# Altium schematic sheet [03] - 28Pins Schematic.SchDoc (part 1 of 3)
size E portrait; DocumentNumber: 3; SheetNumber: 3; SheetTotal: 5
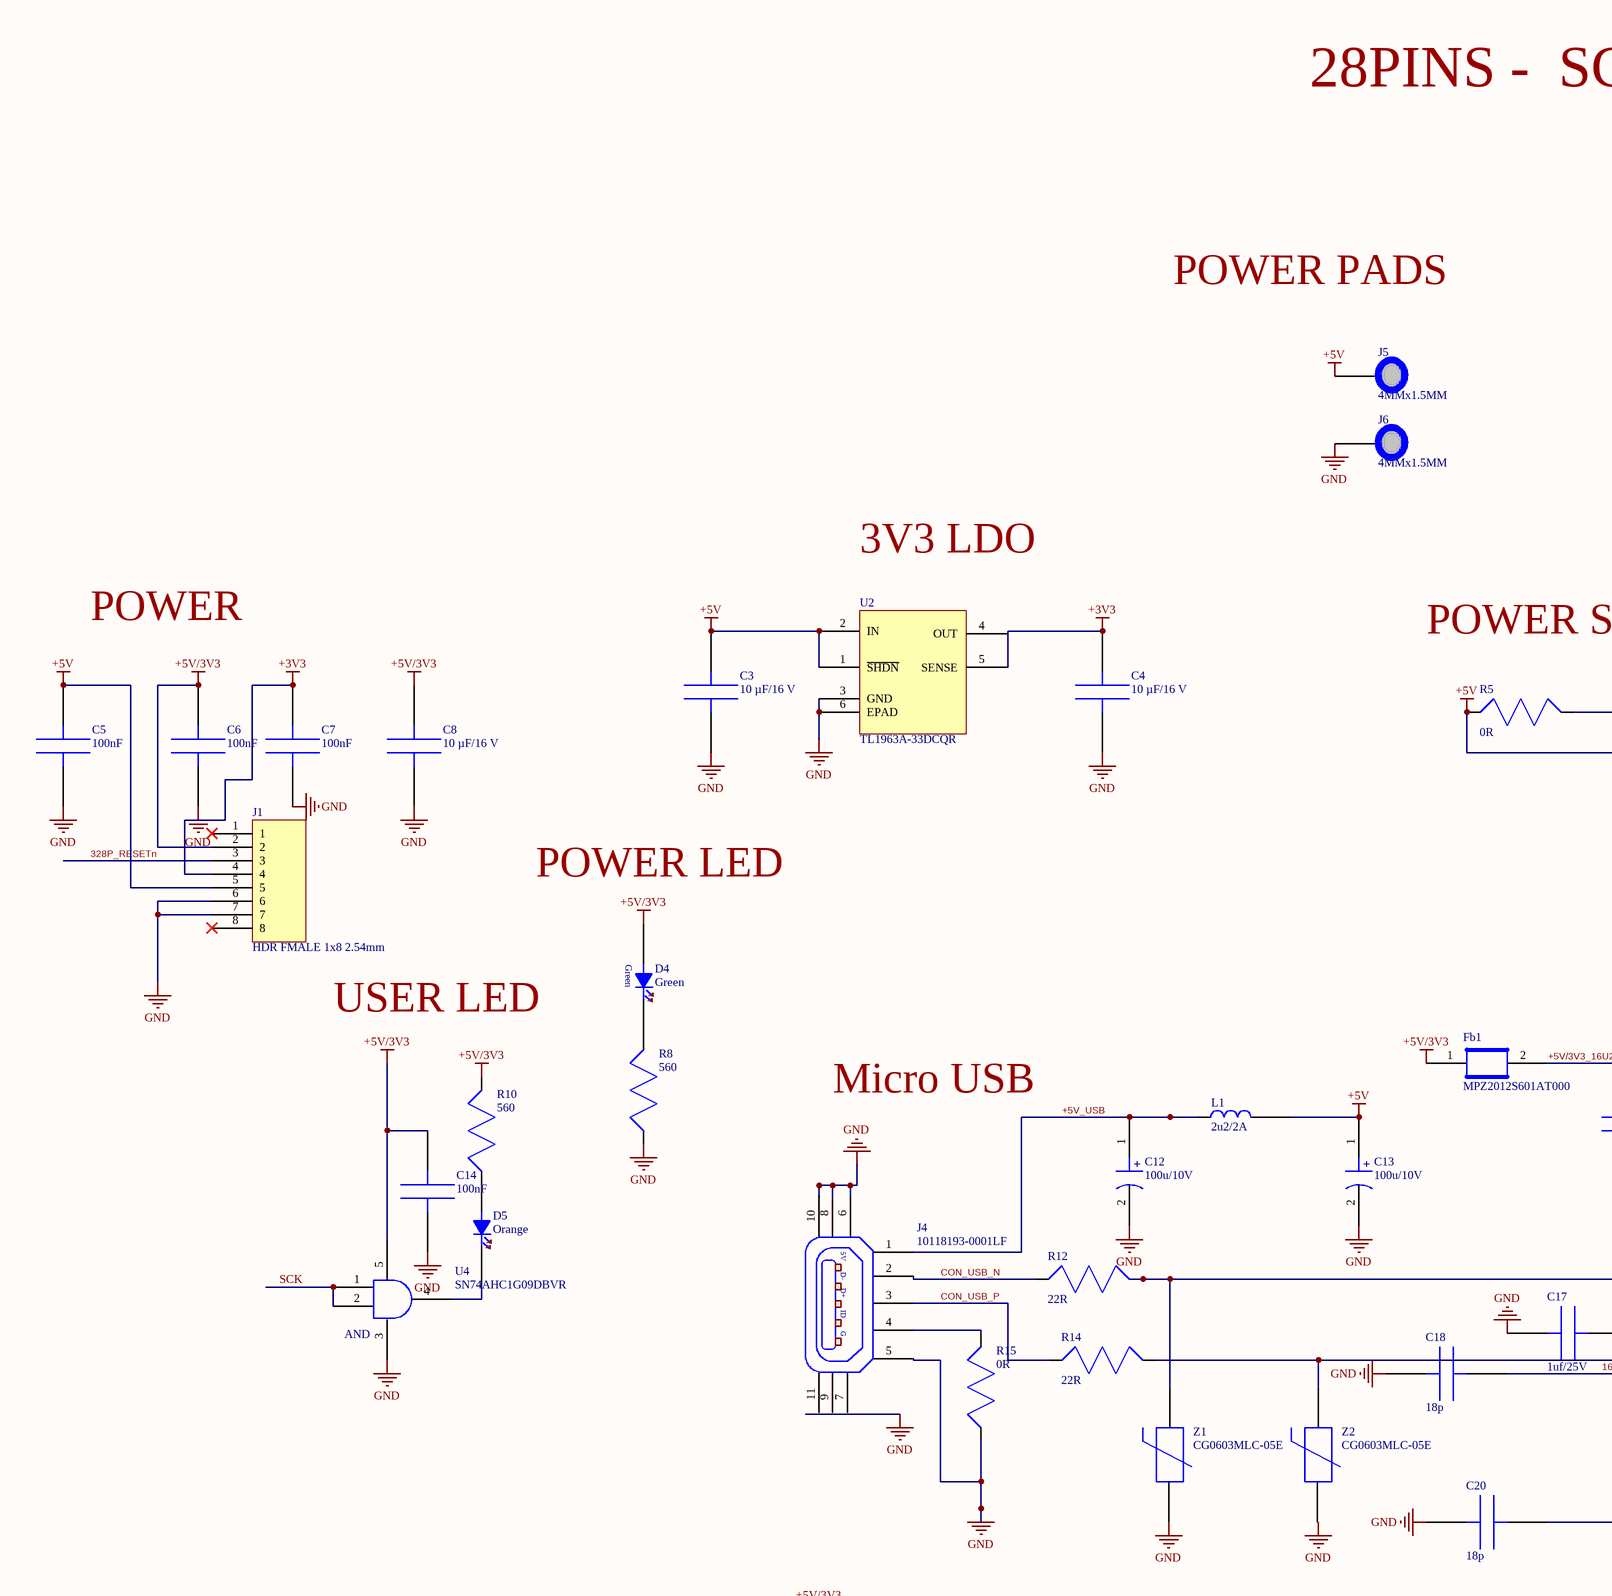
[diagram p0: [03] - 28Pins Schematic.SchDoc, top left]
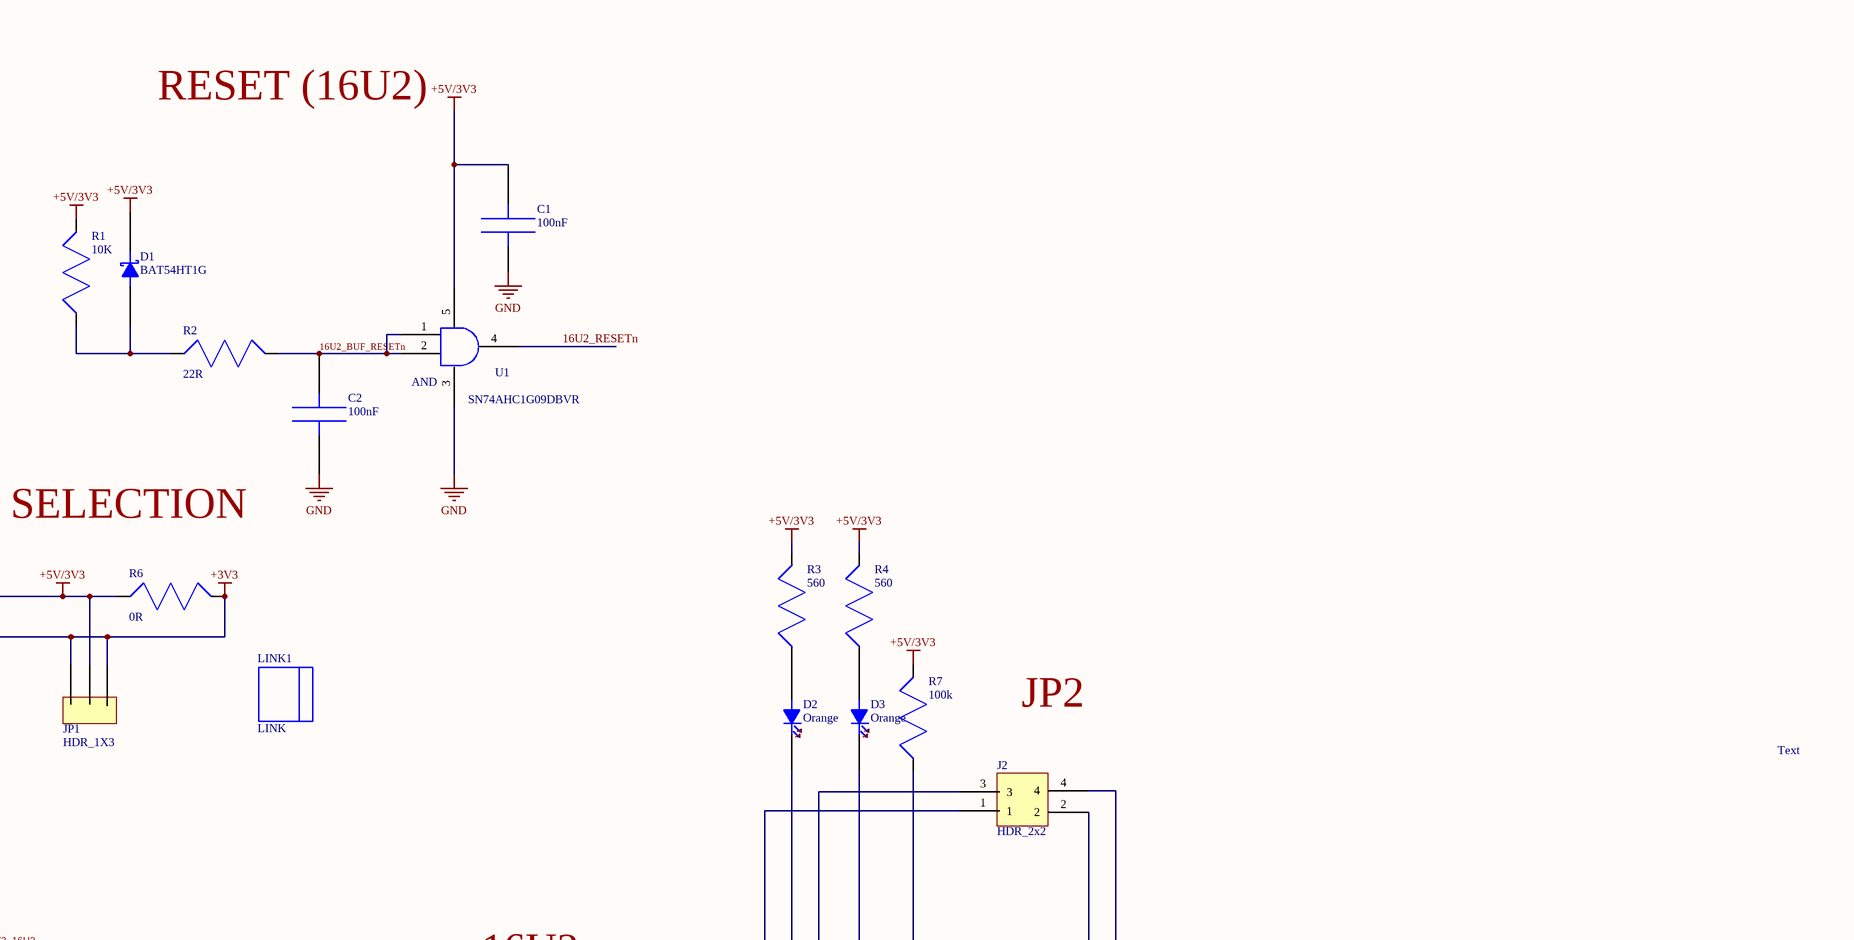
[diagram p1: [03] - 28Pins Schematic.SchDoc, top right]
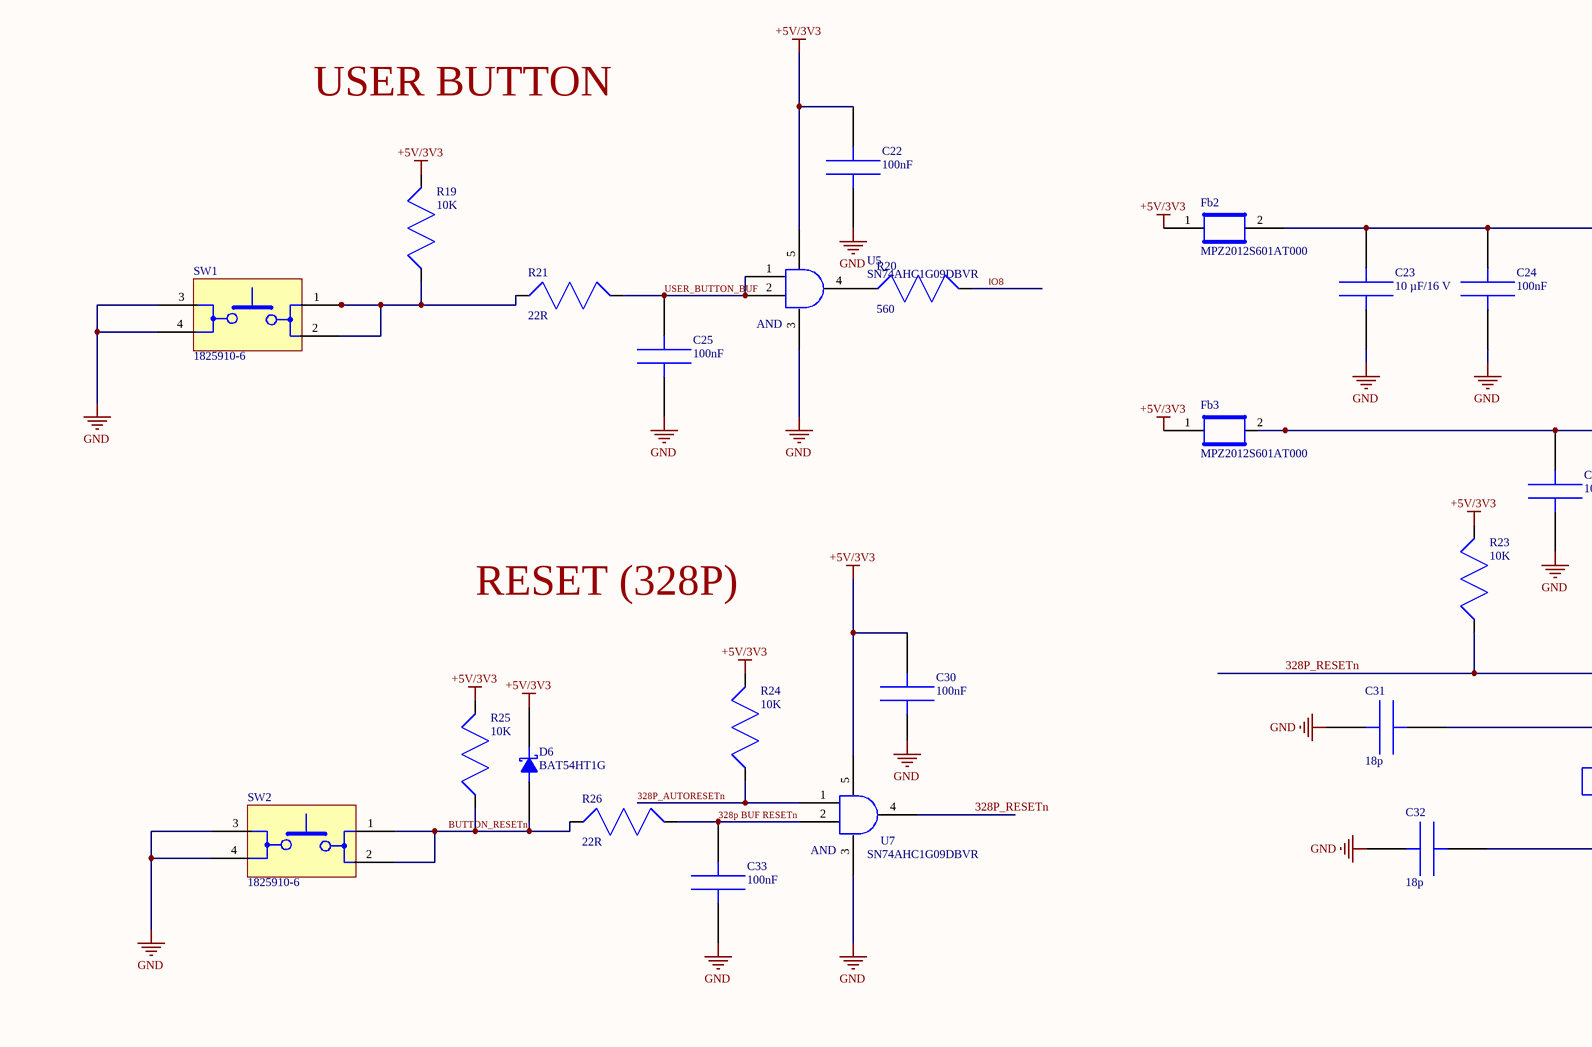
[diagram p2: [03] - 28Pins Schematic.SchDoc, bottom left]
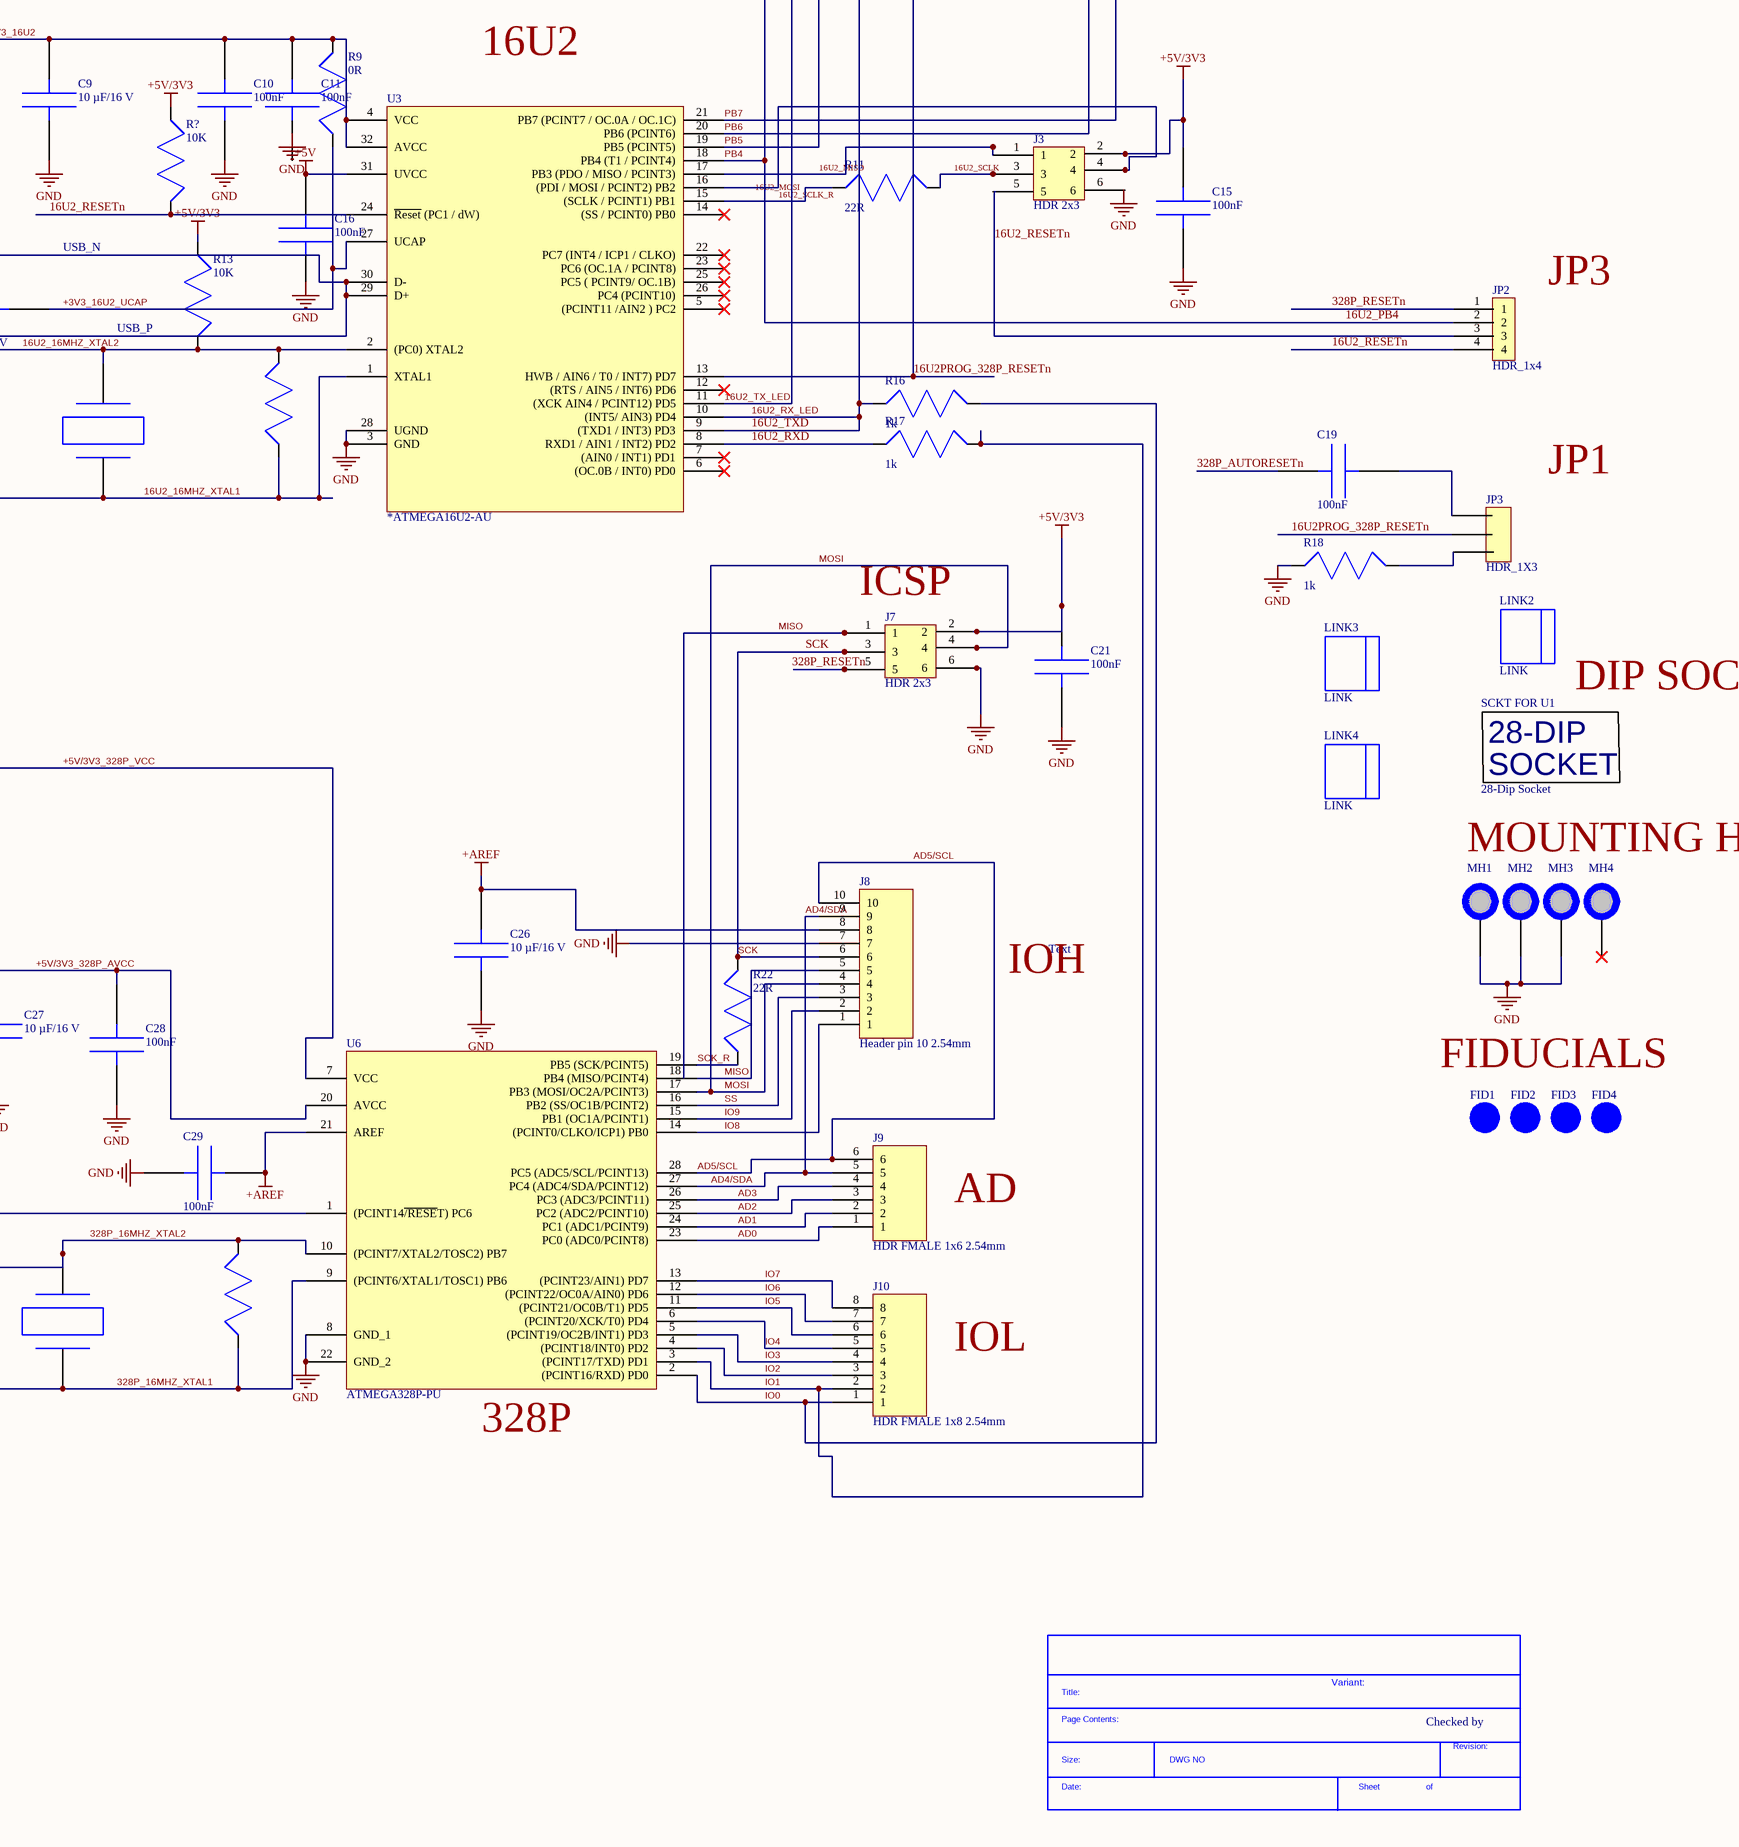
[diagram p3: [03] - 28Pins Schematic.SchDoc, bottom right]

## Parts
1  R?  [R0805]  (value not drawn)
1M  R?  [R0805]  (value not drawn)
*?  SDTitleBlock  (value not drawn)  (graphical)
C1  100nF  [C0805 footprint]
C2  100nF  [C0805 footprint]
C3  10 µF/16 V  [C0805 footprint]
C4  10 µF/16 V  [C0805 footprint]
C5  100nF  [C0805 footprint]
C6  100nF  [C0805 footprint]
C7  100nF  [C0805 footprint]
C8  10 µF/16 V  [C0805 footprint]
C9  10 µF/16 V  [C0805 footprint]
C10  100nF  [C0805 footprint]
C11  100nF  [C0805 footprint]
C12  100u/10V  [C_ALU_C_SIZE]
C13  100u/10V  [C_ALU_C_SIZE]
C14  100nF  [C0805 footprint]
C15  100nF  [C0805 footprint]
C16  100nF  [C0805 footprint]
C17  1uf/25V  [C0805 footprint]
C18  18p  [C0805 footprint]
C19  100nF  [C0805 footprint]
C20  18p  [C0805 footprint]
C21  100nF  [C0805 footprint]
C22  100nF  [C0805 footprint]
C23  10 µF/16 V  [C0805 footprint]
C24  100nF  [C0805 footprint]
C25  100nF  [C0805 footprint]
C26  10 µF/16 V  [C0805 footprint]
C27  10 µF/16 V  [C0805 footprint]
C28  100nF  [C0805 footprint]
C29  100nF  [C0805 footprint]
C30  100nF  [C0805 footprint]
C31  18p  [C0805 footprint]
C32  18p  [C0805 footprint]
C33  100nF  [C0805 footprint]
D1  BAT54HT1G  [SOD323]
D2  Orange  [LED_0603]
D3  Orange  [LED_0603]
D4  Green  [LED_0603]
D5  Orange  [LED_0603]
D6  BAT54HT1G  [SOD323]
Fb1  MPZ2012S601AT000  [C0805 footprint]
Fb2  MPZ2012S601AT000  [C0805 footprint]
Fb3  MPZ2012S601AT000  [C0805 footprint]
FID1  FID_1MMC  [FID_40x120D]  (value not drawn)  (no BOM)
FID2  FID_1MMC  [FID_40x120D]  (value not drawn)  (no BOM)
FID3  FID_1MMC  [FID_40x120D]  (value not drawn)  (no BOM)
FID4  FID_1MMC  [FID_40x120D]  (value not drawn)  (no BOM)
J1  HDR FMALE 1x8 2.54mm  [Hdr_Female_1x8_2.54mm]
J2  HDR_2x2  [HDR_2x2_2.54MM]
J3  HDR 2x3  [HDR_2x3_2.54MM]
J4  10118193-0001LF  [10118193]
J5  4MMx1.5MM  [D_WITH_HOLE_4MMx1.5MM]  (no BOM)
J6  4MMx1.5MM  [D_WITH_HOLE_4MMx1.5MM]  (no BOM)
J7  HDR 2x3  [HDR_2x3_2.54MM]
J8  Header pin 10 2.54mm  [Hdr_Female_1x10_2.54mm]
J9  HDR FMALE 1x6 2.54mm  [Hdr_Female_1x6_2.54mm]
J10  HDR FMALE 1x8 2.54mm  [Hdr_Female_1x8_2.54mm]
JP1  HDR_1X3  [Hdr_Female_1x3_2.54mm]
JP2  HDR_1x4  [Hdr_1x4_2.54mm]
JP3  HDR_1X3  [Hdr_Female_1x3_2.54mm]
L1  2u2/2A  [C1210_IND]
LINK1  LINK  (mechanical)
LINK2  LINK  (mechanical)
LINK3  LINK  (mechanical)
LINK4  LINK  (mechanical)
MH1  MH_7.4MMNC_3.2MMD  [MH_7.4MMNC_3.2MMD]  (value not drawn)  (no BOM)
MH2  MH_7.4MMNC_3.2MMD  [MH_7.4MMNC_3.2MMD]  (value not drawn)  (no BOM)
MH3  MH_7.4MMNC_3.2MMD  [MH_7.4MMNC_3.2MMD]  (value not drawn)  (no BOM)
MH4  MH_7.4MMC_3.2MMD  [MH_7.4MMD_3.2MMD]  (value not drawn)  (no BOM)
R1  10K  [R0805]
R2  22R  [R0805]
R3  560  [R0805]
R4  560  [R0805]
R5  0R  [R0805]
R6  0R  [R0805]
R7  100k  [R0805]
R8  560  [R0805]
R9  0R  [R0805]
R10  560  [R0805]
R11  22R  [R0805]
R12  22R  [R0805]
R13  10K  [R0805]
R14  22R  [R0805]
R15  0R  [R0805]
R16  1k  [R0805]
R17  1k  [R0805]
R18  1k  [R0805]
R19  10K  [R0805]
R20  560  [R0805]
R21  22R  [R0805]
R22  22R  [R0805]
R23  10K  [R0805]
R24  10K  [R0805]
R25  10K  [R0805]
R26  22R  [R0805]
R?  10K  [R0805]
SCKT_FOR_U1  28-Dip Socket  [28_DIP_7.62mm_SOCKET]
SW1  1825910-6  [1825910-6]
SW2  1825910-6  [1825910-6]
U1  SN74AHC1G09DBVR  [DBV_SOT_23_5]
U2  TL1963A-33DCQR  [DCQ (R-PDSO-G6)]
U3  *ATMEGA16U2-AU  [TQFP32]
U4  SN74AHC1G09DBVR  [DBV_SOT_23_5]
U5  SN74AHC1G09DBVR  [DBV_SOT_23_5]
U6  ATMEGA328P-PU  [28Pins_DIP28]
U7  SN74AHC1G09DBVR  [DBV_SOT_23_5]
Y1  ABM7-16.000MHZ-D2Y-T  [ABM7_v1_1_BIG]  (value not drawn)
Y2  ABM7-16.000MHZ-D2Y-T  [ABM7_v1_1_BIG]  (value not drawn)
Z1  CG0603MLC-05E  [R0603]
Z2  CG0603MLC-05E  [R0603]

## Nets
+3V3: C3.2 C4.2 C5.2 C7.2 C13.1 C16.2 J1.4 J1.5 J5.1 JP1.1 JP1.3 L1.2 R5.1 R6.2 U2.1(~{SHDN}) U2.2(IN) U2.5(SENSE) U3.31(UVCC)  [also labelled +5V]
+5V/3V3: C1.2 C6.2 C8.2 C14.2 C15.2 C21.2 C22.2 C30.2 D1.1(Cathode) D4.2(Anode) D6.1(Cathode) Fb1.1 Fb2.1 Fb3.1 J1.2 J3.2 J7.2 JP1.2 R1.2 R3.2 R4.2 R5.2 R6.1 R7.2 R10.2 R13.1 R19.2 R23.2 R24.2 R25.2 R?.1 U1.5 U4.5 U5.5 U7.5
+AREF: C26.2 C29.2 J8.8 U6.21(AREF)
GND: C2.1 C3.1 C4.1 C5.1 C6.1 C7.1 C8.1 C9.1 C10.1 C12.2 C13.2 C14.1 C15.1 C17.2 C18.1 C20.1 C21.1 C22.1 C23.1 C24.1 C25.1 C26.1 C27.1 C28.1 C29.1 C31.1 C32.1 C33.1 J1.6 J1.7 J4.5 J6.1 J7.6 J8.7 MH1.1 MH2.1 MH3.1 R8.1 R15.1 R18.1 SW1.3 SW1.4 SW2.3 SW2.4 U1.3 U2.3(GND) U2.6(EPAD) U3.3(GND) U3.28(UGND) U4.3 U5.3 U6.8(GND_1) U6.22(GND_2) U7.3 Z1.1
16U2_16MHZ_XTAL1: 1.1 C20.2 U3.1(XTAL1) Y1.1
16U2_16MHZ_XTAL2: 1.2 C18.2 R13.2 U3.2((PC0)_XTAL2) Y1.2
16U2_BUF_RESETn: C2.2 R2.2 U1.1 U1.2
16U2_MISO: J3.1 U3.17(PB3_(PDO_/_MISO_/_PCINT3))
16U2_MOSI: J3.4 U3.16((PDI_/_MOSI_/_PCINT2)_PB2)
16U2_PB4: J2.1 JP2.2 U3.18(PB4_(T1_/_PCINT4))  [also labelled PB4]
16U2_RESETn: JP2.3 JP2.4 R?.2 U1.4 U3.24(~{Reset}_(PC1_/_dW))
16U2_RX_LED: D3.1(Cathode) R16.1 U3.9((TXD1_/_INT3)_PD3) U3.10((INT5/_AIN3)_PD4)  [also labelled 16U2_TXD]
16U2_RXD: R17.1 U3.8(RXD1_/_AIN1_/_INT2)_PD2)
16U2_SCLK: J3.3 R11.2
16U2_SCLK_R: R11.1 U3.15((SCLK_/_PCINT1)_PB1)
16U2_TX_LED: D2.1(Cathode) U3.11((XCK_AIN4_/_PCINT12)_PD5)
16U2PROG_328P_RESETn: JP3.2 R7.1 U3.13(HWB_/_AIN6_/_T0_/_INT7)_PD7)
328p BUF RESETn: C33.2 R26.2 U7.2
328P_16MHZ_XTAL1: 1M.1 C32.2 U6.9((PCINT6/XTAL1/TOSC1)_PB6) Y2.1
328P_16MHZ_XTAL2: 1M.2 C31.2 U6.10((PCINT7/XTAL2/TOSC2)_PB7) Y2.2
328P_AUTORESETn: C19.1 R24.1 U7.1
328P_RESETn: J1.3 JP2.1 R23.1 U6.1((PCINT14~{/RESE}T)_PC6) U7.4
+3V3_16U2_UCAP: C17.1 R9.1 U3.27(UCAP)
+5V/3V3_16U2: C9.2 C10.2 C11.2 Fb1.2 R9.2 U3.4(VCC) U3.32(AVCC)
+5V/3V3_328P_AVCC: C27.2 C28.2 Fb3.2 U6.20(AVCC)
+5V/3V3_328P_VCC: C23.2 C24.2 Fb2.2 U6.7(VCC)
+5V_USB: C12.1 J4.1 L1.1
\: R19.1 R21.1 SW1.1 SW1.2
AD0: J9.1 U6.23(PC0_(ADC0/PCINT8))
AD1: J9.2 U6.24(PC1_(ADC1/PCINT9))
AD2: J9.3 U6.25(PC2_(ADC2/PCINT10))
AD3: J9.4 U6.26(PC3_(ADC3/PCINT11))
AD4/SDA: J8.9 J9.5 U6.27(PC4_(ADC4/SDA/PCINT12))
AD5/SCL: J8.10 J9.6 U6.28(PC5_(ADC5/SCL/PCINT13))
BUTTON_RESETn: D6.2(Anode) R25.1 R26.1 SW2.1 SW2.2
CON_USB_N: J4.2 R12.1
CON_USB_P: J4.3 R14.1
IO0: J10.1 R16.2 U6.2((PCINT16/RXD)_PD0)
IO1: J10.2 R17.2 U6.3((PCINT17/TXD)_PD1)
IO2: J10.3 U6.4((PCINT18/INT0)_PD2)
IO3: J10.4 U6.5((PCINT19/OC2B/INT1)_PD3)
IO4: J10.5 U6.6((PCINT20/XCK/T0)_PD4)
IO5: J10.6 U6.11((PCINT21/OC0B/T1)_PD5)
IO6: J10.7 U6.12((PCINT22/OC0A/AIN0)_PD6)
IO7: J10.8 U6.13((PCINT23/AIN1)_PD7)
IO8: J8.1 R20.2 U6.14((PCINT0/CLKO/ICP1)_PB0)
IO9: J8.2 U6.15(PB1_(OC1A/PCINT1))
MISO: J7.1 J8.5 U6.18(PB4_(MISO/PCINT4))
MOSI: J7.4 J8.4 U6.17(PB3_(MOSI/OC2A/PCINT3))
PB5: J2.3 U3.19(PB5_(PCINT5))
PB6: J2.2 U3.20(PB6_(PCINT6))
PB7: J2.4 U3.21(PB7_(PCINT7_/_OC.0A_/_OC.1C))
SCK: J7.3 J8.6 R22.2 U4.1 U4.2
SCK_R: R22.1 U6.19(PB5_(SCK/PCINT5))
SS: J8.3 U6.16(PB2_(SS/OC1B/PCINT2))
USER_BUTTON_BUF: C25.2 R21.2 U5.1 U5.2
NetC19_2: C19.2 JP3.1
NetD1_2: D1.2(Anode) R1.1 R2.1
NetD2_2: D2.2(Anode) R3.1
NetD3_2: D3.2(Anode) R4.1
NetD4_1: D4.1(Cathode) R8.2
NetD5_1: D5.1(Cathode) U4.4
NetJ4_4: J4.4 R15.2
NetJP3_3: JP3.3 R18.2
NetR12_2: R12.2 R14.2 U3.29(D+) U3.30(D-) Z1.2 Z2.2
NetR20_1: R20.1 U5.4

Not connected (* = marked no-connect by the designer): C1 1; C11 1; C16 1; C30 1; D5 2(Anode); J1 1* 8*; J3 5 6; J4 6 7 8 9 10 11; J7 5; MH4 1*; R10 1; U2 4(OUT); U3 5((PCINT11_/AIN2_)_PC2)* 6((OC.0B_/_INT0)_PD0)* 7((AIN0_/_INT1)_PD1)* 12((RTS_/_AIN5_/_INT6)_PD6)* 14((SS_/_PCINT0)_PB0)* 22(PC7_(INT4_/_ICP1_/_CLKO))* 23(PC6_(OC.1A_/_PCINT8))* 25(PC5_(_PCINT9/_OC.1B))* 26(PC4_(PCINT10))*; Z2 1

## Notes on the sheet
- 28PINS -  SCHEMATIC
- RESET (16U2)
- POWER PADS
- 3V3 LDO
- POWER
- POWER SELECTION
- JP2
- Text
- POWER LED
- USER LED
- Micro USB
- 16U2
- USB_N
- JP3
- USB_P
- JP1
- USER BUTTON
- (near J7) ICSP
- DIP SOCKET
- MOUNTING HOLES
- IOH
- FIDUCIALS
- RESET (328P)
- AD
- IOL
- (near U6) 328P
- Variant:
- Checked by
- Labels drawn without touching a wire or pin: 328P_RESETn, GND
- 10
- 9
- 8
- 7
- 6
- 5
- 4
- 3
- DWG. NO.
- 2
- 1
- REV.
- SHT.
- REVISION
- DESCRIPTION
- DATE
- APPROVED
- H
- THIS DOCUMENT AND THE DATA DISCLOSED HEREIN OR HEREWITH IS THE PROPERTY OF ALTIUM LIMITED AND MAY BE FREELY DISTRIBUTED IN WHOLE. NO RIGHTS ARE RESERVED OR EXPRESS OR IMPLIED WARANTEE GIVEN.
- G
- F
- E
- D
- C
- B
- ENG:
- DSN:
- APPROVALS
- PROJECT
- DOCUMENT REVISION:
- DESIGN ITEM:
- A
- CHK:
- BOM:
- REFERENCE DOCUMENTS
- PROJECT REVISION:
- TITLE
- FAB DWG:
- PCB DWG:
- ASSY DWG:
- SCALE:
- SIZE
- CAGE CODE
- FILE NAME
- DWG NO.
- SHEET
- OF
- REV
- (in symbol 4828-3004-CP) 28-DIP; SOCKET
- (in symbol 10118193-0001LF) 5V; D-; D+; ID; G
- (in symbol EEE-1AA101WR) +
- (in symbol SDTitleBlock) Title:; Page Contents:; Revision:; Size:; DWG NO; Date:; Sheet; of
- (in symbol SN74AHC1G09DBVR) AND